# EAGLE schematic WiFi-relays-for-ventilation (EAGLE 9.6.2)
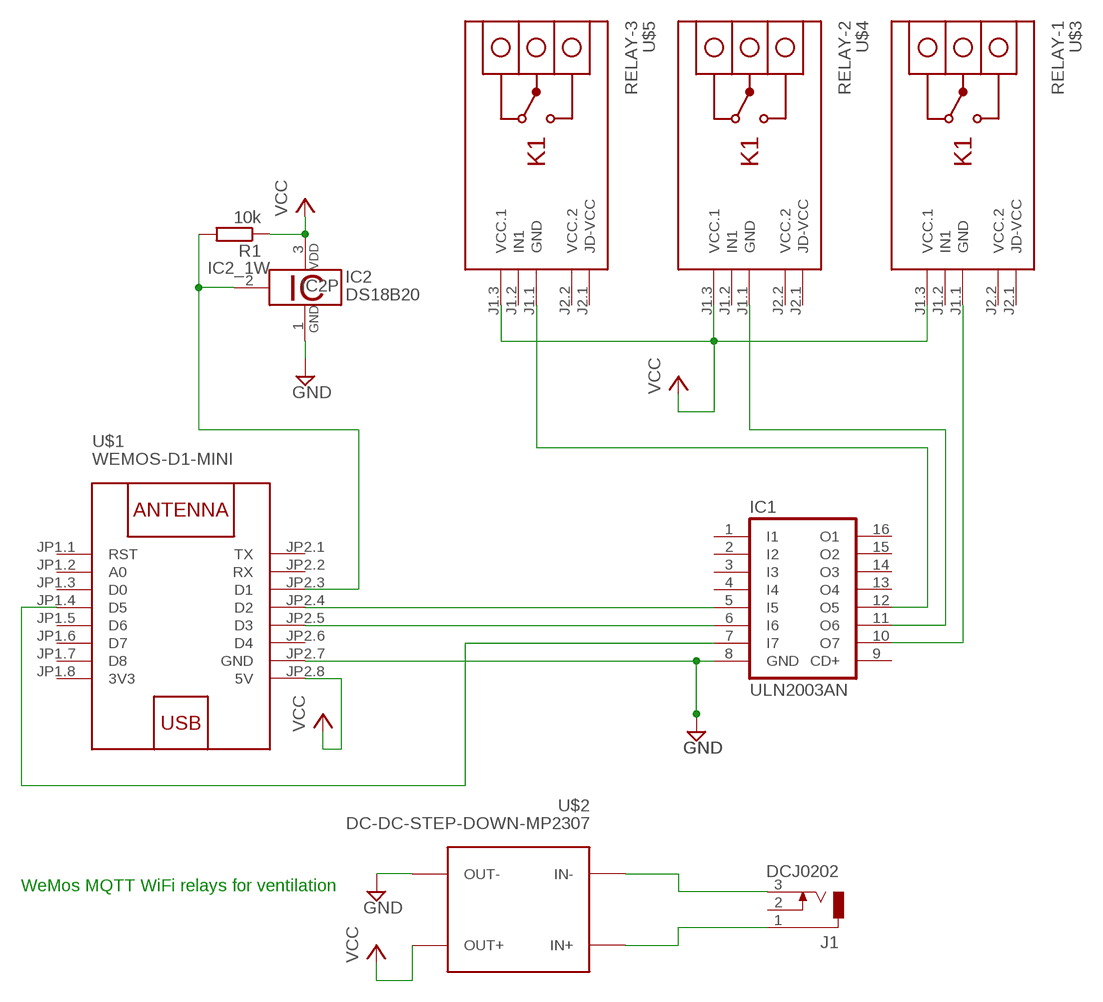
[diagram p0: schematic, sheet 1]

## Parts
IC1  ULN2003AN  [DIL16]
IC2  DS18B20  [TO92-]
J1  DCJ0202  [DCJ0202]
R1  10k  R-EU_0204/2V  [0204V]
U$1  WEMOS-D1-MINI  [WEMOS-D1-MINI]
U$2  DC-DC-STEP-DOWN-MP2307  [DC-DC-STEP-DOWN-MP2307]
U$3  RELAY-1  RELAY-1-SRD  [RELAY-1-SRD]
U$4  RELAY-2  RELAY-1-SRD  [RELAY-1-SRD]
U$5  RELAY-3  RELAY-1-SRD  [RELAY-1-SRD]

## Nets
GND: IC1.8(GND) IC2.1 U$1.JP2.7(GND) U$2.OUT-
N$1: IC2.2 R1.2 U$1.JP2.3(D1)
N$2: IC1.7(I7) U$1.JP1.4(D5)
N$3: IC1.6(I6) U$1.JP2.5(D3)
N$4: IC1.5(I5) U$1.JP2.4(D2)
N$5: J1.3 U$2.IN-
N$6: IC1.10(O7) U$3.J1.1(GND)
N$7: J1.1 U$2.IN+
N$8: IC1.11(O6) U$4.J1.1(GND)
N$9: IC1.12(O5) U$5.J1.1(GND)
VCC: IC2.3 R1.1 U$1.JP2.8(5V) U$2.OUT+ U$3.J1.3(VCC.1) U$4.J1.3(VCC.1) U$5.J1.3(VCC.1)
Unconnected: IC1.1(I1) IC1.2(I2) IC1.3(I3) IC1.4(I4) IC1.9(CD+) IC1.13(O4) IC1.14(O3) IC1.15(O2) IC1.16(O1) J1.2 U$1.JP1.1(RST) U$1.JP1.2(A0) U$1.JP1.3(D0) U$1.JP1.5(D6) U$1.JP1.6(D7) U$1.JP1.7(D8) U$1.JP2.1(TX) U$1.JP2.2(RX) U$1.JP2.6(D4) U$3.J1.2(IN1) U$3.J2.1(JD-VCC) U$4.J1.2(IN1) U$4.J2.1(JD-VCC) U$5.J1.2(IN1) U$5.J2.1(JD-VCC)

## Notes on the sheet
- WeMos MQTT WiFi relays for ventilation

## Power pins joined to a net without a drawn wire
3V3: U$1.JP1.8(3V3)
VCC.2: U$3.J2.2(VCC.2) U$4.J2.2(VCC.2) U$5.J2.2(VCC.2)

## Library data of the parts
IC1 = uln-udn:ULN2003A: DRIVER ARRAY
IC2 = 1wire:DS18B20: Programmable Resolution Digital Thermometer This chip provides a onewire thermosensor with approx. 0.5°C accuracy. A programmable over/undertemperure alarm is available. The precision can be set from 9..12 bits. Notes: Vdd must be applied for accurate measurements at low temperatures, as the parasite power circuit otherwise heats the sensor. If parasite power is used, Vdd has to be connected to GND. The DS1822 is a low-cost thermometer chip, the DS18S20 is similar to the DS18B20, but with 9 Bit precision only. Author: Jan Kandziora <jjj@gmx.de>
J1 = con-jack:DCJ0202: DC POWER JACK Source: DCJ0202.pdf; OC_FARNELL: unknown; OC_NEWARK: unknown
R1 = resistor:R-EU_: RESISTOR, European symbol
U$1 = diy-modules:WEMOS-D1-MINI: WEMOS D1 mini: Mini Wi-Fi Board based on ESP-8266 device More details can be found here: https://www.wemos.cc/product/d1-mini.html Click here to find device on ebay.com <http://www.ebay.com/sch/wemos+d1+mini+nodemcu>
U$2 = diy-modules:DC-DC-STEP-DOWN-MP2307: DC/DC Step-Down Regulator based on MP2307DN chip MP2307 datasheet available here: https://cdn-shop.adafruit.com/datasheets/MP2307_r1.9.pdf Click here to find device on ebay.com <http://www.ebay.com/sch/dc+dc+3a+mini+converter>
U$3-U$5 = diy-modules:RELAY-1-SRD: 1-Channel Relay Module based on SRD-05VDC-SL-C relays Click here to find device on ebay.com <http://www.ebay.com/sch/one+channel+isolated+relay+5v>